# EasyEDA Pro project 8CH_ADC_CAPTURE_CARD.epro, board 8CH_ADC_CARD_V3.1
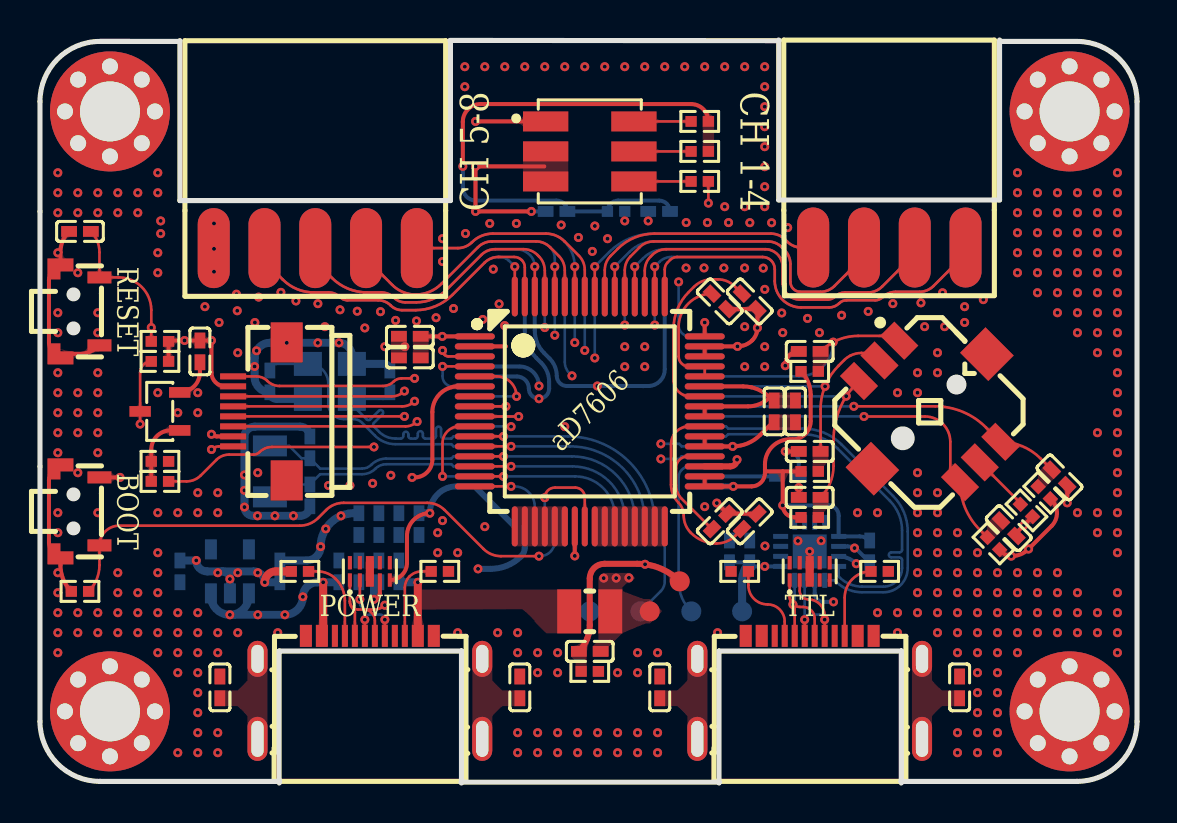
[diagram p12: board, top side]
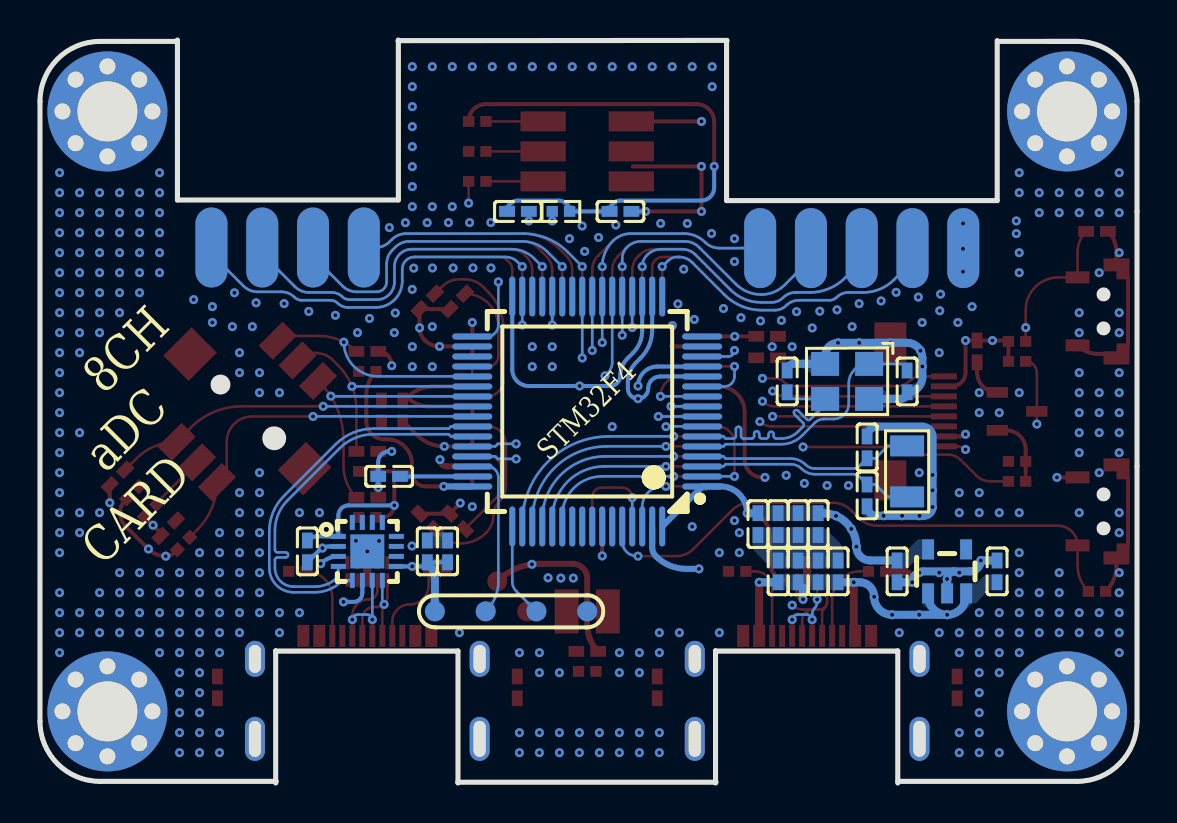
[diagram p13: board, bottom side, seen from below]

Outline 54.87 x 37.15 mm; copper layers: Top Layer, Inner1, Inner2, Bottom Layer. Coordinates in mm from the lower left corner of the outline.
Outline path: 3,37.08 arc(0.88,36.2) 0,34.08 0,3.08 arc(0.88,0.96) 3,0.08 11.97,0.08 ; 3,37.08 4.48,37.08 ; 3,37.08 6.96,37.08 ; 33.97,0.04 21.06,0.04 ; 36.96,37.12 20.5,37.13 ; 48.01,37.08 51.87,37.08 arc(53.99,36.2) 54.87,34.08 54.87,3.08 arc(53.99,0.96) 51.87,0.08 43.06,0.08
Stack: Top Layer 0.035mm 外层铜厚1oz / Dielectric1 0.2104mm 7628 RC49% 8.6mil / Inner1 0.0152mm 内层铜厚 / Dielectric2 1.065mm 1.1mm H/HOZ 含铜 / Inner2 0.0152mm 内层铜厚 / Dielectric3 0.2104mm 7628 RC49% 8.6mil / Bottom Layer 0.035mm 外层铜厚1oz

## Design rules (mm)
net RXD: DP1
net TXD: DP1
net OSC_IN: DP3
net OSC_OUT: DP3
net OSC_32_IN: DP2
net OSC_32_OUT: DP2
net OTG_D+: DP4
net OTG_D-: DP4
template: 自定义配置
spacing copperThickness1oz (default): track to track 0.102, other pairs 0.152 to 0.3
spacing copperThickness2oz: track to track 0.203, other pairs 0.152 to 0.3
spacing SIGNAL: track to track 0.26, other pairs 0.152 to 0.3
track width copperThickness1oz (default): min 0.127, default 0.254, max 2.54
track width copperThickness2oz: min 0.203, default 0.254, max 2.54
track width ADC_CH: min 0.13, default 0.13, max 0.13
track width POWER: min 0.2, default 0.3, max 1
track width SIGNAL: min 0.13, default 0.13, max 0.13
differential pair differentialPair (default): width min 0.127, default 0.254, max 2.54; gap min 0.152, default 0.152
via viaSize (default): diameter min 0.45, default 0.45, max 0.45; hole min 0.2, default 0.2, max 0.2
net NRST uses SIGNAL
net BOOT0 uses SIGNAL
net IPS_SDA uses SIGNAL
net IPS_SCL uses SIGNAL
net DVCC uses POWER
net DGND uses POWER
net IPS_BL uses SIGNAL
net AGND uses POWER
net AVCC uses POWER
net AGND_CH0 uses SIGNAL
net ADC_CH0 uses ADC_CH, SIGNAL
net AGND_CH1 uses SIGNAL
net AGND_CH2 uses SIGNAL
net AGND_CH3 uses SIGNAL
net AGND_CH4 uses SIGNAL
net AGND_CH5 uses SIGNAL
net AGND_CH6 uses SIGNAL
net ADC_CH6 uses ADC_CH, SIGNAL
net AGND_CH7 uses SIGNAL
net ADC_CH7 uses ADC_CH, SIGNAL
net ADC_CH5 uses ADC_CH, SIGNAL
net ADC_CH4 uses ADC_CH, SIGNAL
net ADC_CH3 uses ADC_CH, SIGNAL
net ADC_CH2 uses ADC_CH, SIGNAL
net ADC_CH1 uses ADC_CH, SIGNAL
net ADC_RESET uses SIGNAL
net ADC_CONVST_B uses SIGNAL
net ADC_CONVST_A uses SIGNAL
net ADC_RANGE uses SIGNAL
net ADC_OS2 uses SIGNAL
net ADC_OS1 uses SIGNAL
net ADC_OS0 uses SIGNAL
net IPS_CS uses SIGNAL
net ADC_DB7 uses SIGNAL
net ADC_DB0 uses SIGNAL
net ADC_FRSTDATA uses SIGNAL
net ADC_BUSY uses SIGNAL
net ADC_CS uses SIGNAL
net ADC_RD uses SIGNAL
net RXD uses SIGNAL
net TXD uses SIGNAL
net TTL_D+ uses SIGNAL
net TTL_D- uses SIGNAL
net OSC_IN uses SIGNAL
net OSC_OUT uses SIGNAL
net OSC_32_IN uses SIGNAL
net OSC_32_OUT uses SIGNAL
net UP uses SIGNAL
net PRRESS uses SIGNAL
net LEFT uses SIGNAL
net DOWN uses SIGNAL
net RIGHT uses SIGNAL
net OTG_D+ uses SIGNAL
net OTG_D- uses SIGNAL
net USER uses SIGNAL
net IPS_RESET uses SIGNAL
net IPS_DC uses SIGNAL
net VCC_POWER uses POWER
net SWCLK uses SIGNAL
net SWDIO uses SIGNAL

## Placement (name value [footprint] x y rotation side)
C34  100nF  [C0402]  2 27.58 0 top
C58  12pF  [C0402]  13.5 14.38 90 bottom
C59  12pF  [C0402]  13.5 16.78 270 bottom
C60  10pF  [C0402]  11.5 20.08 270 bottom
C61  10pF  [C0402]  17.5 20.08 270 bottom
C65  100nF  [C0402]  24 4.78 270 top
C72  100nF  [C0402]  38.5 21.58 180 top
C81  4.7uF  [C0402]  30.97 28.58 180 bottom
C103  100nF  [C0402]  8 21.58 270 top
C104  1uF  [C0402]  34 13.08 45 top
C105  1uF  [C0402]  35.5 13.08 45 top
C106  1uF  [C0402]  35.5 24.08 315 top
C107  10uF  [C0402]  34 24.08 315 top
C108  100nF  [C0402]  46 4.78 270 top
C122  4.7uF  [C0402]  18.5 22.34 0 top
C130  4.7uF  [C0402]  15.95 12.95 90 bottom
C133  100nF  [C0402]  51 15.28 315 top
C134  100nF  [C0402]  38.5 14.28 180 top
C135  100nF  [C0402]  48.46 12.74 135 top
C136  100nF  [C0402]  38.5 16.58 0 top
C137  4.7uF  [C0402]  37.41 15.33 0 bottom
C138  100nF  [C0402]  35.5 11.58 90 bottom
C139  100nF  [C0402]  41.5 11.58 270 bottom
C151  100nF  [C0402]  14.95 10.58 270 bottom
C152  100nF  [C0402]  15.95 10.58 270 bottom
C153  100nF  [C0402]  16.95 10.58 270 bottom
C154  4.7uF  [C0402]  17.95 10.58 270 bottom
C155  10uF  [C0402]  12 10.58 90 bottom
C158  100nF  [C0402]  27.5 6.58 0 top
C165  100nF  [C0402]  16.95 12.95 270 bottom
C166  100nF  [C0402]  17.95 12.95 270 bottom
C167  100nF  [C0402]  18.96 12.95 270 bottom
C168  4.7uF  [C0402]  37.79 18.58 270 top
C169  100nF  [C0402]  9 4.78 270 top
C170  100nF  [C0402]  31 4.78 270 top
C171  10uF  [C0402]  7 10.58 270 bottom
C174  10uF  [C0402]  34.49 11.58 270 bottom
C175  10uF  [C0402]  25.84 28.58 180 bottom
C176  100nF  [C0402]  18.5 21.26 0 top
C177  100nF  [C0402]  36.72 18.58 270 top
FPC1  AFC01-S08FCA-00  [fpc-smd_p0.50-8p_fgs-xj-h2.0]  11 18.58 270 top
L1  10uH  [IND-SMD_L2.5-W2.0]  27.5 8.58 0 top
LED6  TC5050RGBF08-3CJH-AF53A  [led-smd_6p-l5.0-w5.0-tl_tc5050rgbf08]  27.5 31.58 0 top
NOREF  -  [Pad_e126]  5.75 3.58 45 top
NOREF#2  -  [Pad_e116]  51.5 31.33 45 top
NOREF#3  -  [Pad_e111]  51.5 35.83 45 top
NOREF#4  -  [Pad_e43]  1.91 31.99 45 top
NOREF#5  -  [Pad_e127]  5.09 5.17 45 top
NOREF#6  -  [Pad_e129]  1.91 5.17 45 top
NOREF#7  -  [Pad_e122]  49.25 3.58 45 top
NOREF#8  -  [Pad_e135]  3.5 1.33 45 top
NOREF#9  -  [Pad_e115]  49.91 31.99 45 top
NOREF#10  -  [Pad_e120]  51.5 5.83 45 top
NOREF#11  -  [Pad_e114]  49.25 33.58 45 top
NOREF#12  -  [Pad_e48]  5.09 35.17 45 top
NOREF#13  -  [Pad_e137]  3.5 3.58 0 top
NOREF#14  -  [Pad_e138]  51.5 3.58 0 top
NOREF#15  -  [Pad_e136]  51.5 33.58 0 top
NOREF#16  -  [Pad_e130]  1.25 3.58 45 top
NOREF#17  -  [Pad_e119]  53.09 5.17 45 top
NOREF#18  -  [Pad_e46]  3.5 31.33 45 top
NOREF#19  -  [Pad_e123]  49.91 1.99 45 top
NOREF#20  -  [Pad_e113]  49.91 35.17 45 top
NOREF#21  -  [Pad_e124]  51.5 1.33 45 top
NOREF#22  -  [Pad_e125]  53.09 1.99 45 top
NOREF#23  -  [Pad_e49]  5.09 31.99 45 top
NOREF#24  -  [Pad_e118]  53.75 3.58 45 top
NOREF#25  -  [Pad_e134]  3.5 33.58 0 top
NOREF#26  -  [Pad_e121]  49.91 5.17 45 top
NOREF#27  -  [Pad_e117]  53.09 31.99 45 top
NOREF#28  -  [Pad_e60]  5.75 33.58 45 top
NOREF#29  -  [Pad_e139]  5.09 1.99 45 top
NOREF#30  -  [Pad_e63]  53.75 33.58 45 top
NOREF#31  -  [Pad_e64]  53.09 35.17 45 top
NOREF#32  -  [Pad_e132]  1.91 1.99 45 top
NOREF#33  -  [Pad_e47]  1.25 33.58 45 top
NOREF#34  -  [Pad_e58]  1.91 35.17 45 top
NOREF#35  -  [Pad_e128]  3.5 5.83 45 top
NOREF#36  -  [Pad_e51]  3.5 35.83 45 top
Q1  S8050  [SOT-23-3_L2.9-W1.3-P1.90-LS2.3-BR]  6 18.58 0 top
R18  10kΩ  [R0402]  2 9.58 180 top
R20  10kΩ  [R0402]  6 22.08 0 top
R77  5.1kΩ  [R0402]  13 10.58 180 top
R78  5.1kΩ  [R0402]  20 10.58 0 top
R79  100Ω  [R0402]  49.34 13.63 135 top
R84  680Ω  [R0402]  33 33.08 0 top
R97  10Ω  [R0402]  6 21.08 0 top
R101  5.1kΩ  [R0402]  35 10.58 180 top
R102  5.1kΩ  [R0402]  42 10.58 0 top
R103  680Ω  [R0402]  33 31.58 0 top
R104  680Ω  [R0402]  33 30.08 0 top
R106  10kΩ  [R0402]  38.5 20.58 180 top
R107  10kΩ  [R0402]  50.23 14.52 315 top
R108  10kΩ  [R0402]  38.5 13.28 180 top
R109  10kΩ  [R0402]  47.69 11.98 315 top
R110  10kΩ  [R0402]  38.5 15.58 180 top
R111  10kΩ  [R0402]  28.82 28.58 180 bottom
R112  0Ω  [R0402]  27.5 5.58 0 top
R115  4.7kΩ  [R0402]  6 15.08 0 top
R116  3.3kΩ  [R0402]  6 16.08 180 top
SW4  TM-4175-B-B  [SW-SMD_TM-4175-B-X]  44.5 18.58 315 top
SW5  TS24CA  [SW-SMD_TS24CA]  2 23.58 90 top
SW6  TS24CA  [SW-SMD_TS24CA]  2 13.58 90 top
U20  CH343P  [TQFN-16_L3.0-W3.0-P0.50-BL-EP1.7]  38.5 11.58 270 bottom
U29  AD7606BSTZ  [LQFP-64_L10.0-W10.0-P0.50-LS12.0-BL]  27.5 18.58 270 top
U33  2.54-2*4  [hdr-th_8p-p2.54-v-f-r2-c4-s2.54]  42.49 26.28 0 top
U34  -  [焊盘]  30.5 8.58 0 top
U35  STM32F405RGT6  [焊盘]  32 10.08 0 top
U35#2  -  [LQFP-64_L10.0-W10.0-P0.50-LS12.0-BL]  27.5 18.58 90 bottom
U36  -  [焊盘]  35.12 8.58 180 bottom
U37  RCLAMP0524P-ES  [DFN2510-10_L2.5-W1.0-P0.50-BL]  16.5 10.58 0 top
U37#2  -  [焊盘]  27.5 8.58 180 bottom
U37#3  -  [焊盘]  30.04 8.58 180 bottom
U38  RCLAMP0524P-ES  [DFN2510-10_L2.5-W1.0-P0.50-BL]  38.5 10.58 0 top
U38#2  -  [焊盘]  32.58 8.58 180 bottom
U47  2.54-2*5  [hdr-th_10p-p2.54-v-f-r2-c5-s2.54]  13.77 26.25 0 top
U48  HT7833  [SOT-23-5_L2.9-W1.6-P0.95-LS2.8-BL]  9.5 10.58 180 bottom
USB2  TYPEC-302-BRP16SC16  [USB-C-SMD_TYPEC-302-BRP16SC16]  16.5 4.78 0 top
USB3  TYPEC-302-BRP16SC16  [USB-C-SMD_TYPEC-302-BRP16SC16]  38.5 4.78 0 top
X1  8MHz  [OSC-SMD_4P-L3.2-W2.5-BL]  14.5 20.08 0 bottom
X2  32.768kHz  [OSC-SMD_L3.2-W1.5]  11.5 15.58 90 bottom

## Footprints (pads in the part's own frame, mm; a bottom-side part is the same pattern mirrored in y, then rotated)
C0402
  rect 0.79x0.54 smd: 1(-0.545,0) 2(0.545,0)
DFN2510-10_L2.5-W1.0-P0.50-BL
  rect 0.2x0.665 smd: 1(-1,-0.433) 2(-0.5,-0.433) 4(0.5,-0.433) 5(1,-0.433) 6(1,0.433) 7(0.5,0.433) 9(-0.5,0.433) 10(-1,0.433)
  rect 0.4x0.665 smd: 3(0,-0.433) 8(0,0.433)
fpc-smd_p0.50-8p_fgs-xj-h2.0
  rect 0.3x1.3 smd: 1(-1.75,-1.34) 2(-1.252,-1.339) 3(-0.75,-1.34) 4(-0.25,-1.34) 5(0.25,-1.34) 6(0.75,-1.34) 7(1.25,-1.34) 8(1.75,-1.34)
  rect 2x1.6 smd: 9(3.45,1.34) 10(-3.45,1.34)
hdr-th_8p-p2.54-v-f-r2-c4-s2.54
  oval 1.6x4 smd: 1(-3.81,0.5) 3(-1.27,0.5) 5(1.27,0.5) 7(3.81,0.5)
  oval 1.6x4 smd far side: 2(-3.81,0.5) 4(-1.27,0.5) 6(1.27,0.5) 8(3.81,0.5)
hdr-th_10p-p2.54-v-f-r2-c5-s2.54
  oval 1.6x4 smd: 1(-5.08,0.5) 3(-2.54,0.5) 5(0,0.5) 7(2.54,0.5) 9(5.08,0.5)
  oval 1.6x4 smd far side: 2(-5.08,0.5) 4(-2.54,0.5) 6(0,0.5) 8(2.54,0.5) 10(5.08,0.5)
IND-SMD_L2.5-W2.0
  rect 1.2x2.2 smd: 1(1.028,0) 2(-1.028,0)
led-smd_6p-l5.0-w5.0-tl_tc5050rgbf08
  rect 2.265x1 smd: 1(-2.208,1.5) 2(-2.208,0) 3(-2.208,-1.5) 4(2.208,-1.5) 5(2.208,0) 6(2.208,1.5)
LQFP-64_L10.0-W10.0-P0.50-LS12.0-BL
  oval 0.3x2 smd: 1(-3.75,-5.75) 2(-3.25,-5.75) 3(-2.75,-5.75) 4(-2.25,-5.75) 5(-1.75,-5.75) 6(-1.25,-5.75) 7(-0.75,-5.75) 8(-0.25,-5.75) 9(0.25,-5.75) 10(0.75,-5.75) 11(1.25,-5.75) 12(1.75,-5.75) 13(2.25,-5.75) 14(2.75,-5.75) 15(3.25,-5.75) 16(3.75,-5.75) 33(3.75,5.75) 34(3.25,5.75) 35(2.75,5.75) 36(2.25,5.75) 37(1.75,5.75) 38(1.25,5.75) 39(0.75,5.75) 40(0.25,5.75) 41(-0.25,5.75) 42(-0.75,5.75) 43(-1.25,5.75) 44(-1.75,5.75) 45(-2.25,5.75) 46(-2.75,5.75) 47(-3.25,5.75) 48(-3.75,5.75)
  oval 2x0.3 smd: 17(5.75,-3.75) 18(5.75,-3.25) 19(5.75,-2.75) 20(5.75,-2.25) 21(5.75,-1.75) 22(5.75,-1.25) 23(5.75,-0.75) 24(5.75,-0.25) 25(5.75,0.25) 26(5.75,0.75) 27(5.75,1.25) 28(5.75,1.75) 29(5.75,2.25) 30(5.75,2.75) 31(5.75,3.25) 32(5.75,3.75) 49(-5.75,3.75) 50(-5.75,3.25) 51(-5.75,2.75) 52(-5.75,2.25) 53(-5.75,1.75) 54(-5.75,1.25) 55(-5.75,0.75) 56(-5.75,0.25) 57(-5.75,-0.25) 58(-5.75,-0.75) 59(-5.75,-1.25) 60(-5.75,-1.75) 61(-5.75,-2.25) 62(-5.75,-2.75) 63(-5.75,-3.25) 64(-5.75,-3.75)
OSC-SMD_4P-L3.2-W2.5-BL
  rect 1.4x1.2 smd: 1(-1.1,-0.875) 2(1.1,-0.875) 3(1.1,0.875) 4(-1.1,0.875)
OSC-SMD_L3.2-W1.5
  rect 1.05x1.7 smd: 1(-1.275,0) 2(1.275,0)
Pad_e43
  round 1.3 hole 0.8: 1(0,0)
Pad_e46
  round 1.3 hole 0.8: 1(0,0)
Pad_e47
  round 1.3 hole 0.8: 1(0,0)
Pad_e48
  round 1.3 hole 0.8: 1(0,0)
Pad_e49
  round 1.3 hole 0.8: 1(0,0)
Pad_e51
  round 1.3 hole 0.8: 1(0,0)
Pad_e58
  round 1.3 hole 0.8: 1(0,0)
Pad_e60
  round 1.3 hole 0.8: 1(0,0)
Pad_e63
  round 1.3 hole 0.8: 1(0,0)
Pad_e64
  round 1.3 hole 0.8: 1(0,0)
Pad_e111
  round 1.3 hole 0.8: 1(0,0)
Pad_e113
  round 1.3 hole 0.8: 1(0,0)
Pad_e114
  round 1.3 hole 0.8: 1(0,0)
Pad_e115
  round 1.3 hole 0.8: 1(0,0)
Pad_e116
  round 1.3 hole 0.8: 1(0,0)
Pad_e117
  round 1.3 hole 0.8: 1(0,0)
Pad_e118
  round 1.3 hole 0.8: 1(0,0)
Pad_e119
  round 1.3 hole 0.8: 1(0,0)
Pad_e120
  round 1.3 hole 0.8: 1(0,0)
Pad_e121
  round 1.3 hole 0.8: 1(0,0)
Pad_e122
  round 1.3 hole 0.8: 1(0,0)
Pad_e123
  round 1.3 hole 0.8: 1(0,0)
Pad_e124
  round 1.3 hole 0.8: 1(0,0)
Pad_e125
  round 1.3 hole 0.8: 1(0,0)
Pad_e126
  round 1.3 hole 0.8: 1(0,0)
Pad_e127
  round 1.3 hole 0.8: 1(0,0)
Pad_e128
  round 1.3 hole 0.8: 1(0,0)
Pad_e129
  round 1.3 hole 0.8: 1(0,0)
Pad_e130
  round 1.3 hole 0.8: 1(0,0)
Pad_e132
  round 1.3 hole 0.8: 1(0,0)
Pad_e134
  round 6 hole 3: 101(0,0)
Pad_e135
  round 1.3 hole 0.8: 1(0,0)
Pad_e136
  round 6 hole 3: 101(0,0)
Pad_e137
  round 6 hole 3: 101(0,0)
Pad_e138
  round 6 hole 3: 101(0,0)
Pad_e139
  round 1.3 hole 0.8: 1(0,0)
R0402
  rect 0.566x0.54 smd: 1(-0.433,0) 2(0.433,0)
SOT-23-3_L2.9-W1.3-P1.90-LS2.3-BR
  rect 1.07x0.532 smd: 1(0.99,-0.95) 2(0.99,0.95) 3(-0.99,0)
SOT-23-5_L2.9-W1.6-P0.95-LS2.8-BL
  rect 0.6x1 smd: 1(-0.95,-1.1) 2(0,-1.1) 3(0.95,-1.1) 4(0.95,1.1) 5(-0.95,1.1)
SW-SMD_TM-4175-B-X
  rect 1.7x1 smd: 1(-3.575,1.425) 2(-3.575,0.028) 3(-3.575,-1.425) 4(3.575,1.425) 5(3.575,-0.028) 6(3.575,-1.425)
  rect 2x1.8 smd: 7(0,4.05) 7(0,-4.05)
SW-SMD_TS24CA
  custom 1.05x1.3 smd: 1(-2.125,0.975) 2(2.125,0.975)
  rect 0.6x1.2 smd: 3(-1.7,-0.975) 4(1.7,-0.975)
TQFN-16_L3.0-W3.0-P0.50-BL-EP1.7
  rect 0.25x0.75 smd: 1(-0.749,-1.45) 2(-0.248,-1.45) 3(0.252,-1.45) 4(0.751,-1.45) 9(0.75,1.45) 10(0.25,1.45) 11(-0.25,1.45) 12(-0.749,1.45)
  rect 0.75x0.25 smd: 5(1.45,-0.75) 6(1.45,-0.25) 7(1.45,0.25) 8(1.45,0.75) 13(-1.45,0.75) 14(-1.45,0.25) 15(-1.45,-0.25) 16(-1.45,-0.75)
  rect 1.7x1.7 smd: 17(0.001,0)
USB-C-SMD_TYPEC-302-BRP16SC16
  rect 0.6x1.1 smd: 1(-3.2,2.575) 2(-2.4,2.575) 11(2.4,2.575) 12(3.2,2.575)
  rect 0.3x1.1 smd: 3(-1.75,2.575) 4(-1.25,2.575) 5(-0.75,2.575) 6(-0.25,2.575) 7(0.25,2.575) 8(0.75,2.575) 9(1.25,2.575) 10(1.75,2.575)
  oval 1x1.8 hole 0.61x1.4: 13(-5.62,1.425) 14(5.62,1.425)
  oval 1x2.2 hole 0.61x1.8: 15(-5.62,-2.575) 16(5.62,-2.575)
焊盘
  round 1 smd: 1(0,0)

## Nets
AGND: C104.2 C105.2 C106.2 C107.2 C122.1 C158.1 C168.1 C176.1 C177.1 R112.1 U29.2 U29.17 U29.18 U29.19 U29.20 U29.21 U29.22 U29.25 U29.26 U29.27 U29.28 U29.29 U29.30 U29.31 U29.32 U29.35 U29.40 U29.41 U29.43 U29.46 U29.47 U35.1 U47.1 U47.2
AGND_CH0: U29.50 U33.8
AGND_CH1: U29.52 U33.6
AGND_CH2: U29.54 U33.4
AGND_CH3: U29.56 U33.2
AGND_CH4: U29.58 U47.10
AGND_CH5: U29.60 U47.8
AGND_CH6: U29.62 U47.6
AGND_CH7: U29.64 U47.4
AVCC: C122.2 C158.2 C168.2 C176.2 C177.2 L1.1 LED6.1 U29.1 U29.37 U29.38 U29.48 U34.1
DGND: C34.1 C58.1 C59.1 C60.2 C61.1 C65.1 C72.2 C81.1 C103.2 C108.1 C130.1 C133.2 C134.2 C135.1 C136.1 C137.2 C138.2 C139.2 C151.1 C152.1 C153.1 C154.1 C155.1 C165.2 C166.2 C167.2 C169.1 C170.1 C171.1 C174.1 C175.1 FPC1.7 FPC1.9 FPC1.10 Q1.2 R18.2 R77.2 R78.2 R79.1 R84.2 R101.2 R102.2 R103.2 R111.2 R112.2 R116.1 SW5.1 SW5.2 SW5.3 SW6.1 SW6.2 U20.2 U20.17 U35#2.12 U35#2.18 U35#2.63 U37.3 U37.8 U37#2.1 U38.3 U38.8 U48.2 USB2.1 USB2.12 USB3.1 USB3.12 X1.2 X1.4
DVCC: C103.1 C130.2 C138.1 C139.1 C155.2 C165.1 C166.1 C167.1 C174.2 C175.2 FPC1.2 LED6.2 LED6.3 R20.2 R97.2 R106.2 R107.2 R108.2 R109.2 R110.2 SW6.4 U20.1 U20.3 U20.6 U20.9 U29.6 U29.23 U29.33 U29.34 U35#2.1 U35#2.13 U35#2.19 U35#2.32 U35#2.48 U35#2.64 U36.1 U37.5 U48.5
VCC_POWER: C151.2 C152.2 C153.2 C154.2 C171.2 L1.2 U37.4 U48.1 U48.3 USB2.2 USB2.11
ADC_BUSY: U29.14 U35#2.53
ADC_CH0: U29.49 U33.7
ADC_CH1: U29.51 U33.5
ADC_CH2: U29.53 U33.3
ADC_CH3: U29.55 U33.1
ADC_CH4: U29.57 U47.9
ADC_CH5: U29.59 U47.7
ADC_CH6: U29.61 U47.5
ADC_CH7: U29.63 U47.3
ADC_CONVST_A: U29.9 U35#2.8
ADC_CONVST_B: U29.10 U35#2.2
ADC_CS: U29.13 U35#2.52
ADC_DB0: U29.16 U35#2.62
ADC_DB7: U29.24 U35#2.61
ADC_FRSTDATA: U29.15 U35#2.54
ADC_OS0: U29.3 U35#2.14
ADC_OS1: U29.4 U35#2.11
ADC_OS2: U29.5 U35#2.10
ADC_RANGE: U29.8 U35#2.9
ADC_RD: U29.12 U35#2.51
ADC_RESET: U29.11 U35#2.50
BOOT0: R18.1 SW6.3 U35#2.60
DOWN: C135.2 R109.1 SW4.6 U35#2.41
IPS_BL: R115.2 U35#2.22
IPS_CS: FPC1.1 U35#2.20
IPS_DC: FPC1.5 U35#2.24
IPS_RESET: FPC1.6 U35#2.25
IPS_SCL: FPC1.3 U35#2.21
IPS_SDA: FPC1.4 U35#2.23
LEFT: C134.1 R108.1 SW4.3 U35#2.39
NRST: C34.2 R20.1 SW5.4 U35#2.7
OSC_32_IN: C58.2 U35#2.3 X2.1
OSC_32_OUT: C59.2 U35#2.4 X2.2
OSC_IN: C60.1 U35#2.5 X1.1
OSC_OUT: C61.2 U35#2.6 X1.3
OTG_D+: U35#2.45 U37.2 USB2.6 USB2.8
OTG_D-: U35#2.44 U37.1 USB2.5 USB2.7
PRRESS: C136.2 R110.1 SW4.2 U35#2.38
RIGHT: C133.1 R107.1 SW4.4 U35#2.40
RXD: U20.4 U35#2.43
SWCLK: U35#2.49 U37#3.1
SWDIO: U35#2.46 U38#2.1
TTL_D+: U20.7 U38.2 USB3.6 USB3.8
TTL_D-: U20.8 U38.1 USB3.5 USB3.7
TXD: U20.5 U35#2.42
UP: C72.1 R106.1 SW4.1 U35#2.37
USER: R104.2 U35#2.33
$1N3863: R77.1 USB2.4
$1N3864: R78.1 USB2.10
$1N14437: C81.2 U35#2.31
$1N15249: R101.1 USB3.4
$1N15250: R102.1 USB3.10
$1N20405: LED6.6 R84.1
$1N20444: LED6.5 R103.1
$1N20483: LED6.4 R104.1
$1N20665: R79.2 SW4.5
$1N21331: R111.1 U35#2.28
$1N23387: C137.1 U35#2.47
$1N27774: C65.2 USB2.14 USB2.16
$1N27783: C169.2 USB2.13 USB2.15
$1N27801: C108.2 USB3.14 USB3.16
$1N27807: C170.2 USB3.13 USB3.15
$1N29540: Q1.1 R115.1 R116.2
$1N29631: FPC1.8 Q1.3 R97.1
$2N5032: C104.1 U29.36
$2N5113: C105.1 U29.39
$2N5155: C106.1 U29.42
$2N5232: C107.1 U29.44 U29.45

Pads without a net: NOREF 1; NOREF#2 1; NOREF#3 1; NOREF#4 1; NOREF#5 1; NOREF#6 1; NOREF#7 1; NOREF#8 1; NOREF#9 1; NOREF#10 1; NOREF#11 1; NOREF#12 1; NOREF#13 101; NOREF#14 101; NOREF#15 101; NOREF#16 1; NOREF#17 1; NOREF#18 1; NOREF#19 1; NOREF#20 1; NOREF#21 1; NOREF#22 1; NOREF#23 1; NOREF#24 1; NOREF#25 101; NOREF#26 1; NOREF#27 1; NOREF#28 1; NOREF#29 1; NOREF#30 1; NOREF#31 1; NOREF#32 1; NOREF#33 1; NOREF#34 1; NOREF#35 1; NOREF#36 1; SW4 7; U20 10 11 12 13 14 15 16; U29 7; U35#2 15 16 17 26 27 29 30 34 35 36 55 56 57 58 59; U37 6 7 9 10; U38 4 5 6 7 9 10; U48 4; USB2 3 9; USB3 2 3 9 11

## Via types
v1: diameter 0.45, hole 0.2, Top Layer to Bottom Layer, 497 vias

## Routing (per net, layer and track width the routed paths; a pad name or vN(x,y) marks a point on that pad's centre or on a via; arc(x,y) is an arc through that point)
AGND: length 30.4
  Top Layer w0.2: C105.2 C104.2 v1(33.85,14) ; U29.40 U29.41 35.41,18.83 arc(36,18.95) 36.5,19.28 arc(36.08,19.6) 35.59,19.79 arc(35.38,19.82) 35.17,19.83 U29.43 ; C107.2 C106.2 v1(35.89,22.76) arc(35.82,22.42) 35.63,22.14 arc(35.29,21.91) v1(34.89,21.83) U29.47 U29.46 ; U47.1 8.7,26.73 v1(8.7,26.71) v1(8.7,25.57) ; U29.2 23.31,21.83
  Top Layer w0.3: U29.35 34.53,15.83 arc(34.77,15.93) v1(34.87,16.17) ; C158.1 arc(27.19,6.88) 27.37,7.21 arc(27.47,7.55) 27.5,7.9 27.5,10.23 arc(27.71,10.75) 28.23,10.96 29.88,10.96 arc(30.07,10.96) v1(30.27,10.94) arc(31.07,10.72) 31.78,10.28 arc(31.89,10.19) U35.1
  Bottom Layer w0.3: v1(8.7,27.98) v1(8.7,26.71)
  vias: v1(8.25,23.82) v1(8.96,23.03) v1(9.83,24.44) v1(9.87,23.61) v1(10.75,23.03) v1(10.94,24.3) v1(12.05,24.53) v1(12.8,24.1) v1(13.9,23.97) v1(14.25,22.82) v1(15.01,23.66) v1(15.87,23.59) v1(16.25,22.75) v1(17.03,23.57) v1(17.25,21.82) v1(17.79,23.13) v1(18.25,21.82) v1(18.83,23.11) v1(19.81,23.27) v1(20.13,27.22) v1(20.13,26.07) v1(20.69,23.73) v1(21.25,35.82) v1(21.25,34.82) v1(21.28,27.48) v1(22.15,23.18) v1(22.25,35.82) v1(22.25,12.82) v1(22.5,27.98) v1(22.67,25.69) v1(22.96,23.96) v1(23.24,22.87) v1(23.25,35.82) v1(23.83,27.98) v1(24.25,35.82) v1(25.25,35.82) v1(26.07,27.9) v1(26.25,35.82) v1(26.25,17.82) v1(26.93,27.28) v1(27.25,35.82) v1(27.63,26.58) v1(27.75,27.85) v1(28.25,35.82) v1(28.39,27.22) v1(29.25,35.82) v1(29.25,21.82) v1(29.25,20.82) v1(30.25,35.82) v1(30.25,21.82) v1(30.25,20.82) v1(31.25,35.82) v1(32.25,35.82) v1(32.32,28.03) v1(32.32,25.75) v1(33.22,25.76) v1(33.25,35.82) v1(33.25,13.82) v1(33.38,28.02) v1(34.21,25.75) v1(34.25,35.82) v1(34.25,28.82) v1(34.44,28.02) v1(35.24,25.75) v1(35.25,35.82) v1(35.25,28.82) v1(35.25,22.82) v1(35.25,20.82) v1(35.51,28.02) v1(36.18,25.75) v1(36.25,35.82) v1(36.25,34.82) v1(36.25,33.82) v1(36.25,32.82) v1(36.25,31.82) v1(36.25,30.82) v1(36.25,29.82) v1(36.25,28.82) v1(36.25,24.68) v1(36.25,21.82) v1(36.25,20.82) v1(36.59,28.02) v1(37.1,23.5) v1(37.15,22.52) v1(37.4,27.77) v1(38.39,23.23) v1(38.99,22.52) v1(40.1,23.39) v1(41.43,23.58) v1(42.66,23.97) v1(44.06,24.01) v1(44.25,22.82) v1(45.15,24.51) v1(45.25,22.82) v1(46.25,23.82) v1(46.25,23.03) v1(47.19,24.17)
AGND_CH0: length 20.2
  Top Layer w0.13: U29.50 v1(30.75,25.82)
  Bottom Layer w0.13: v1(30.75,25.82) 30.98,26.05 arc(31.26,26.24) 31.59,26.3 36.14,26.3 arc(36.57,26.13) 36.75,25.69 36.75,25.1 arc(37.14,24.17) 38.07,23.78 39.47,23.78 arc(39.75,23.84) 39.98,23.99 arc(40.15,24.1) 40.34,24.14 41.78,24.14 arc(41.97,24.18) 42.14,24.29 arc(42.44,24.49) 42.8,24.56 43.99,24.56 arc(44.37,24.64) 44.69,24.85 46.3,26.46 U33.8
AGND_CH1: length 18.7
  Top Layer w0.13: U29.52 v1(29.75,25.82)
  Bottom Layer w0.13: U33.6 43.76,26.46 42.12,24.82 arc(41.8,24.61) 41.41,24.53 40.27,24.53 arc(39.99,24.47) 39.75,24.32 arc(39.59,24.21) 39.4,24.17 38.03,24.17 arc(37.4,24.43) 37.14,25.05 37.14,25.82 arc(36.89,26.44) 36.27,26.69 31.28,26.69 arc(30.67,26.57) 30.16,26.23 v1(29.75,25.82)
AGND_CH2: length 17.3
  Top Layer w0.13: U29.54 v1(28.75,25.82)
  Bottom Layer w0.13: U33.4 41.22,26.33 39.74,24.85 arc(39.42,24.64) 39.03,24.56 38.03,24.56 arc(37.68,24.71) 37.53,25.06 37.53,25.95 arc(37.46,26.33) 37.24,26.66 37.11,26.79 arc(36.78,27.01) 36.4,27.08 30.75,27.08 arc(30.07,26.95) 29.49,26.56 v1(28.75,25.82)
AGND_CH3: length 13.2
  Top Layer w0.13: U29.56 v1(27.75,25.82)
  Bottom Layer w0.13: U33.2 38.08,26.78 arc(37.7,26.85) 37.38,27.07 37.27,27.18 arc(36.94,27.4) 36.56,27.47 30.71,27.47 arc(29.5,27.23) 28.47,26.54 27.75,25.82 v1(27.75,25.82)
AGND_CH4: length 10.6
  Top Layer w0.13: v1(26.75,25.82) U29.58
  Bottom Layer w0.13: U47.10 20.9,26.75 arc(21.28,26.82) 21.61,27.04 arc(22.09,27.36) 22.65,27.47 25.32,27.47 arc(25.81,27.38) 26.22,27.1 arc(26.61,26.51) v1(26.75,25.82)
AGND_CH5: length 14
  Top Layer w0.13: v1(25.75,25.82) U29.60
  Bottom Layer w0.13: v1(25.75,25.82) 25.75,26.22 arc(25.69,26.53) 25.51,26.79 arc(25.19,27.01) 24.81,27.08 22.61,27.08 arc(22.23,27.01) 21.91,26.79 20.07,24.95 arc(19.48,24.56) 18.8,24.42 arc(18.15,24.55) 17.61,24.92 16.46,26.07 arc(16.35,26.23) 16.31,26.42 U47.8
AGND_CH6: length 15.2
  Top Layer w0.13: U29.62 v1(24.75,25.82)
  Bottom Layer w0.13: U47.6 13.77,26.3 arc(13.81,26.1) 13.92,25.94 14.6,25.26 arc(15.41,24.72) 16.36,24.53 17.08,24.53 arc(17.42,24.46) 17.71,24.27 arc(17.97,24.09) 18.27,24.03 18.82,24.03 arc(19.63,24.2) 20.33,24.66 22.08,26.41 arc(22.39,26.62) 22.75,26.69 23.8,26.69 arc(24.18,26.62) 24.51,26.4 arc(24.69,26.13) v1(24.75,25.82)
AGND_CH7: length 16.6
  Top Layer w0.13: U29.64 v1(23.75,25.82)
  Bottom Layer w0.13: v1(23.75,25.82) 23.45,26.12 arc(23.25,26.25) 23.01,26.3 22.9,26.3 arc(22.55,26.23) 22.25,26.03 20.63,24.41 arc(19.78,23.84) 18.78,23.64 18.11,23.64 arc(17.8,23.7) 17.54,23.88 arc(17.26,24.07) 16.91,24.14 15.38,24.14 arc(15.19,24.18) 15.02,24.29 arc(14.75,24.47) 14.44,24.53 13.7,24.53 arc(12.86,24.7) 12.14,25.17 11.38,25.94 arc(11.27,26.1) 11.23,26.3 U47.4
AVCC: length 64.7
  Top Layer w0.2: U29.48 v1(33.25,23.03) ; U29.1 v1(20.12,22.33) 19.05,22.33 arc(19.05,22.33) C122.2 ; v1(21.78,33.08) LED6.1 ; 36.5,17.88 36.02,17.4 arc(35.39,16.98) v1(34.65,16.83) U29.37 U29.38
  Inner1 w0.3: 21.57,23.78 22.49,24.7 arc(22.75,24.87) 23.06,24.93 27.42,24.93 arc(28.19,24.61) 28.52,23.84 28.52,19.37 arc(28.9,18.45) 29.81,18.07 33.41,18.07 arc(34.28,17.71) v1(34.65,16.83) ; 21.57,23.78 v1(20.12,22.33) ; 21.57,23.78 21.57,24.41 arc(21.79,25.52) 22.42,26.46 arc(22.98,27.3) 23.18,28.3 23.18,31.79 arc(22.8,32.7) 21.89,33.08 v1(21.78,33.08) ; 34.65,18.53 34.65,18.74 arc(34.47,19.62) 33.98,20.36 arc(33.44,21.17) 33.25,22.12 v1(33.25,23.03) ; 34.65,18.53 v1(34.65,16.83) ; 34.65,18.53 arc(34.63,18.57) 34.6,18.58 ; v1(28.82,10.25) 28.82,11.77 arc(29.18,12.64) 30.04,12.99 34.61,12.99 arc(35.42,13.33) 35.75,14.14 35.75,15.72 arc(35.43,16.51) v1(34.65,16.83) ; v1(28.2,10.24) 29.44,10.24 arc(29.45,10.25) v1(29.46,10.26)
DGND: length 135.7
  Top Layer w0.2: C133.2 v1(51.38,14.01) ; C103.2 8,20.54 arc(7.7,19.83) Q1.2 ; R79.1 v1(49.22,12.89) 48.95,12.63 arc(48.87,12.5) C135.1 ; v1(21.15,30.83) 21.15,33.06 arc(21.41,33.69) 22.04,33.95 32.57,33.95 arc(33.18,33.7) R84.2 ; v1(37.96,14.77) C134.2 ; FPC1.7 8.84,17.33 arc(8.7,17.36) v1(8.58,17.44) ; v1(37.28,20.87) 37.28,20.91 arc(37.48,21.38) C72.2 ; C136.1 v1(37.28,16.58) ; R18.2 arc(1.17,10.18) 1.03,10.89 SW6.1 arc(0.62,11.63) 0.45,12.03 0.45,15.13 arc(0.62,15.54) SW6.2 ; C34.1 arc(1.14,27.11) 1.03,26.54 SW5.2 arc(0.62,25.54) 0.45,25.13 0.45,22.03 arc(0.62,21.63) SW5.1 1.95,21.46 arc(2.5,21.57) SW5.3
  Top Layer w0.4: R77.2 11.79,10.58 arc(11.4,10.42) v1(11.24,10.04) ; U38.3 U38.8 ; U37.3 U37.8
  Inner1 w0.2: v1(37.28,20.87) v1(37.28,16.58) ; v1(24.96,19.22) 24.96,15.66 arc(24.51,14.58) 23.44,14.14 21.15,14.14 arc(20.43,13.84) v1(20.13,13.12)
  Inner2 w0.2: v1(21.15,30.83) 21.15,29.31 arc(20.94,28.79) 20.42,28.58 7.15,28.58 arc(5.93,28.82) v1(4.89,29.52)
  Bottom Layer w0.2: U35#2.12 23.85,20.33 arc(24.28,20.15) 24.45,19.72 arc(24.6,19.37) v1(24.96,19.22) arc(25.32,19.37) 25.47,19.72 25.47,20.05 arc(25.36,20.57) 25.07,21.01 24.83,21.25 arc(24.4,21.89) 24.25,22.66 U35#2.18 ; v1(37.28,16.58) 37.41,16.58 arc(37.8,16.42) 37.96,16.04 v1(37.96,14.77) ; C139.2 40.92,11.62 arc(40.68,11.78) 40.41,11.83 U20.2 ; v1(21.15,30.83) 21.15,29.78 arc(21.34,29.31) 21.8,29.12 25.84,29.12 arc(26.22,28.96) C175.1 R111.2 arc(28.54,28.96) 28.93,29.12 30.97,29.12 arc(31.35,28.96) C81.1
  Bottom Layer w0.3: U35#2.63 24.25,11.78 arc(24.2,11.54) 24.07,11.34 arc(23.37,10.87) 22.54,10.71 v1(21.91,10.71)
  Bottom Layer w0.4: U48.2 v1(9.5,10.2) arc(9.39,10.47) 9.12,10.58 ; 9.12,10.58 8.36,10.58 arc(7.97,10.74) v1(7.81,11.13) C171.1 ; 9.12,10.58 10.7,10.58 arc(11.08,10.42) v1(11.24,10.04) C155.1 ; X1.4 11.83,19.21 arc(11.6,19.3) C60.2 arc(10.96,19.76) 10.74,20.3 v1(10.74,20.83) 10.74,21.24 arc(10.76,21.43) v1(10.83,21.61) arc(11.11,21.9) 11.5,22.01 v1(12.34,22.01) v1(13.9,22.01) v1(14.96,22.01) arc(15.41,21.82) 15.6,21.37 X1.2 17.17,20.96 arc(17.4,20.86) C61.1 ; C58.1 arc(13.36,13.5) 13.02,13.36 v1(12.68,13.36) v1(11.75,13.36) 10.67,13.36 arc(10.36,13.49) v1(10.23,13.8) v1(10.23,14.64) v1(10.23,15.41) 10.23,17.31 arc(10.38,17.67) 10.74,17.82 13.01,17.82 arc(13.36,17.68) C59.1
  vias: v1(0.89,30.52) v1(0.89,29.52) v1(0.89,28.52) v1(0.89,26.52) v1(0.89,23.52) v1(0.89,22.52) v1(0.89,20.52) v1(0.89,19.52) v1(0.89,18.52) v1(0.89,17.52) v1(0.89,16.52) v1(0.89,13.52) v1(0.89,12.52) v1(0.89,10.52) v1(0.89,9.52) v1(0.89,8.52) v1(0.89,7.52) v1(0.89,6.52) v1(1.89,29.52) v1(1.89,28.52) v1(1.89,25.52) v1(1.89,19.52) v1(1.89,18.52) v1(1.89,17.52) v1(1.89,15.52) v1(1.89,8.52) v1(1.89,7.52) v1(2.89,29.52) v1(2.89,28.52) v1(2.89,23.52) v1(2.89,22.52) v1(2.89,20.52) v1(2.89,19.52) v1(2.89,18.52) v1(2.89,17.52) v1(2.89,16.52) v1(2.89,13.52) v1(2.89,8.52) v1(2.89,7.52) v1(3.89,29.52) v1(3.89,28.52) v1(3.89,10.52) v1(3.89,9.52) v1(3.89,8.52) v1(3.89,7.52) v1(4.89,28.52) v1(4.89,9.52) v1(4.89,8.52) v1(4.89,7.52) v1(5.89,30.52) v1(5.89,29.52) v1(5.89,26.52) v1(5.89,25.52) v1(5.89,19.52) v1(5.89,13.52) v1(5.89,11.52) v1(5.89,10.52) v1(5.89,9.52) v1(5.89,8.52) v1(5.89,7.52) v1(5.89,6.52) v1(6.04,27.47) v1(6.89,18.52) v1(6.89,13.52) v1(6.89,8.52) v1(6.89,7.52) v1(6.89,6.52) v1(6.89,5.52) v1(6.89,1.52) v1(7.89,19.52) v1(7.89,18.52) v1(7.89,14.52) v1(7.89,13.52) v1(7.89,8.52) v1(7.89,7.52) v1(7.89,6.52) v1(7.89,5.52) v1(7.89,4.52) v1(7.89,3.52) v1(7.89,2.52) v1(7.89,1.52) v1(8.89,14.52) v1(8.89,13.52) v1(8.89,10.52) v1(8.89,7.52) v1(8.89,6.52) v1(8.89,2.52) v1(8.89,1.52) v1(9.89,21.52) v1(9.89,10.52) v1(9.89,7.52) v1(10.89,15.52) v1(10.88,13.36) v1(10.89,10.52) v1(11.89,7.52) v1(14.43,14.88) v1(15.5,14.88) v1(16.64,14.98) v1(17.55,15.39) v1(19.89,12.52) v1(19.89,11.52) v1(20.89,11.52) v1(20.89,7.52) v1(22.89,7.52) v1(23.89,7.52) v1(23.89,6.52) v1(23.89,2.52) v1(23.89,1.52) v1(24.89,6.52) v1(24.89,5.52) v1(24.89,2.52) v1(24.89,1.52) v1(25.89,6.52) v1(25.89,5.52) v1(25.89,2.52) v1(25.89,1.52) v1(26.89,2.52) v1(26.89,1.52) v1(27.89,2.52) v1(27.89,1.52) v1(28.89,5.52) v1(28.89,2.52) v1(28.89,1.52) v1(29.89,6.52) v1(29.89,5.52) v1(29.89,2.52) v1(29.89,1.52) v1(30.89,6.52) v1(30.89,2.52) v1(30.89,1.52) v1(33.89,7.52) v1(36.26,11.85) v1(37.91,12.1) v1(38.5,11.58) v1(39.07,12.11) v1(40.74,11.75) v1(40.89,13.52) v1(41.89,13.52) v1(41.89,8.52) v1(42.89,19.52) v1(42.89,8.52) v1(42.89,7.52) v1(43.89,20.52) v1(43.89,19.52) v1(43.89,15.52) v1(43.89,14.52) v1(43.89,13.52) v1(43.89,12.52) v1(43.89,11.52) v1(43.89,10.52) v1(43.89,9.52) v1(43.89,8.52) v1(44.89,21.52) v1(44.89,20.52) v1(44.89,14.52) v1(44.89,13.52) v1(44.89,12.52) v1(44.89,11.52) v1(44.89,10.52) v1(44.89,9.52) v1(44.89,8.52) v1(44.89,7.52) v1(45.89,12.52) v1(45.89,11.52) v1(45.89,10.52) v1(45.89,9.52) v1(45.89,8.52) v1(45.89,7.52) v1(45.89,6.52) v1(45.89,2.52) v1(45.89,1.52) v1(46.89,11.52) v1(46.89,10.52) v1(46.89,9.52) v1(46.89,8.52) v1(46.89,7.52) v1(46.89,6.52) v1(46.89,5.52) v1(46.89,4.52) v1(46.89,3.52) v1(46.89,2.52) v1(46.89,1.52) v1(47.89,10.52) v1(47.89,9.52) v1(47.89,8.52) v1(47.89,7.52) v1(47.89,6.52) v1(47.89,5.52) v1(47.89,4.52) v1(47.89,3.52) v1(47.89,2.52) v1(47.89,1.52) v1(48.89,30.52) v1(48.89,29.52) v1(48.89,28.52) v1(48.89,27.52) v1(48.89,26.52) v1(48.89,25.52) v1(48.89,10.52) v1(48.89,9.52) v1(48.89,8.52) v1(48.89,7.52) v1(48.89,6.52) v1(49.89,29.52) v1(49.89,28.52) v1(49.89,27.52) v1(49.89,26.52) v1(49.89,25.52) v1(49.89,24.52) v1(49.89,10.52) v1(49.89,9.52) v1(49.89,8.52) v1(49.89,7.52) v1(50.89,29.52) v1(50.89,28.52) v1(50.89,27.52) v1(50.89,26.52) v1(50.89,25.52) v1(50.89,24.52) v1(50.89,23.52) v1(50.89,10.52) v1(50.89,9.52) v1(50.89,8.52) v1(50.89,7.52) v1(51.89,29.52) v1(51.89,28.52) v1(51.89,27.52) v1(51.89,26.52) v1(51.89,25.52) v1(51.89,24.52) v1(51.89,23.52) v1(51.89,22.52) v1(51.89,13.52) v1(51.89,9.52) v1(51.89,8.52) v1(51.89,7.52) v1(52.89,29.52) v1(52.89,28.52) v1(52.89,27.52) v1(52.89,26.52) v1(52.89,25.52) v1(52.89,24.52) v1(52.89,23.52) v1(52.89,22.52) v1(52.89,21.52) v1(52.89,17.52) v1(52.89,13.52) v1(52.89,12.52) v1(52.89,8.52) v1(52.89,7.52) v1(53.89,30.52) v1(53.89,29.52) v1(53.89,28.52) v1(53.89,27.52) v1(53.89,26.52) v1(53.89,25.52) v1(53.89,24.52) v1(53.89,23.52) v1(53.89,22.52) v1(53.89,21.52) v1(53.89,20.52) v1(53.89,19.52) v1(53.89,18.52) v1(53.89,17.52) v1(53.89,16.52) v1(53.89,15.52) v1(53.89,14.52) v1(53.89,13.52) v1(53.89,12.52) v1(53.89,11.52) v1(53.89,9.52) v1(53.89,8.52) v1(53.89,7.52) v1(53.89,6.52)
DVCC: length 132.8
  Top Layer w0.2: 36.26,15.66 36.26,15.94 arc(36.63,16.82) 37.51,17.18 37.64,17.18 arc(38.28,17.45) 38.55,18.09 38.55,19.42 arc(38.42,20.05) R106.2 ; 36.26,15.66 36.26,15.5 arc(36.07,15.03) 35.59,14.83 v1(34.68,14.83) U29.33 U29.34 ; 36.26,15.66 arc(36.29,15.61) 36.34,15.58 37.15,15.58 ; v1(24.58,28.58) v1(21.78,28.58) v1(21.78,30.83) 25.23,30.83 ; v1(4,15.28) SW6.4 ; 37.15,15.58 R110.2 ; 37.15,15.58 v1(37.15,13.88) arc(37.33,13.46) 37.75,13.28 R108.2 ; U29.6 20.91,19.83 arc(20,19.46) 19.63,18.55 19.63,16.17 arc(19.37,15.54) 18.74,15.28 v1(18.61,15.28) ; R107.2 50.6,14.15 arc(50.8,13.85) 50.87,13.5 arc(50.8,13.15) 50.6,12.85 v1(49.45,11.7) arc(49.05,11.44) v1(48.58,11.34) arc(48.35,11.39) 48.15,11.52 R109.2 ; R97.2 R20.2 arc(6.48,22.12) 6.54,22.13 v1(7.23,22.13) C103.1 v1(8.58,22.13) 8.58,20.53 arc(8.78,20.04) 9.27,19.83 FPC1.2 ; v1(26.75,11.35) U29.23 ; U37.5 arc(18.11,10.4) 18.36,11 18.36,12.35 arc(18.69,13.16) v1(19.5,13.49)
  Inner1 w0.2: v1(24.96,19.85) v1(27.88,19.85) 27.88,19.39 arc(28.45,18.01) 29.83,17.44 32.58,17.44 arc(33.57,17.03) 33.98,16.04 33.98,15.53 arc(34.18,15.04) v1(34.68,14.83) 30.23,14.83 arc(27.77,13.81) v1(26.75,11.35) ; v1(21.78,28.58) 7.18,28.58 arc(6.56,28.46) v1(6.04,28.11)
  Bottom Layer w0.2: C174.2 C138.1 arc(35.56,10.89) 35.71,10.83 v1(36.25,10.83) U20.9 ; U35#2.13 23.99,20.83 arc(24.67,20.54) v1(24.96,19.85) ; C175.2 v1(24.58,28.58) ; v1(39.69,9.06) 39.18,9.06 arc(38.88,9.18) 38.75,9.49 U20.6 ; U35#2.19 24.75,22.62 arc(24.87,22.02) 25.21,21.5 25.49,21.23 arc(25.76,20.83) 25.85,20.36 arc(26,20) 26.36,19.85 v1(27.88,19.85) 30.17,19.85 ; 30.17,19.85 30.42,19.85 arc(31.01,20.09) 31.25,20.68 31.25,24.33 ; 30.17,19.85 arc(30.17,19.85) 30.17,19.84 ; 40.84,10.96 v1(40.83,10.96) arc(40.43,11.24) U20.3 ; v1(37.15,13.88) 39.44,13.88 arc(39.8,13.73) 39.95,13.37 U20.1 41.01,12.33 arc(41.27,12.28) C139.1
  Bottom Layer w0.3: 21.75,14.83 20.84,14.83 arc(19.89,14.44) v1(19.5,13.49) ; U35#2.64 U35#2.1 ; U35#2.48 arc(33.96,14.83) v1(34.68,14.83)
  Bottom Layer w0.4: C155.2 13.35,11.13 arc(13.84,11.33) v1(14.04,11.82) arc(14.1,12.28) v1(14.29,12.71) arc(14.62,13.09) v1(15.06,13.36) arc(15.24,13.42) 15.43,13.47 arc(15.57,13.49) 15.71,13.49 C130.2 ; U36.1 35.12,10.12 arc(35.22,10.62) C138.1 ; C167.1 v1(19.5,13.49)
VCC_POWER: length 17.7
  Top Layer w0.2: U37.4 17,9.48 arc(16.91,9.27) v1(16.71,9.18)
  Top Layer w0.4: v1(14.16,10.04) 14.16,7.42 arc(14.15,7.38) USB2.2 ; v1(18.9,10.04) USB2.11
  Bottom Layer w0.4: U48.1 10.45,9.36 arc(10.17,8.69) v1(9.5,8.41) ; C151.2 v1(14.16,10.04) 13.88,10.04 arc(13.36,9.82) v1(13.15,9.31) arc(12.89,8.67) v1(12.25,8.41) v1(10.9,8.41) v1(9.5,8.41) ; U48.3 8.55,9.36 arc(8.83,8.69) v1(9.5,8.41) ; v1(16.71,9.18) 16.71,9.79 ; C154.2 v1(18.9,10.04)
ADC_BUSY: length 9.4
  Top Layer w0.13: U29.14 v1(23.56,15.83)
  Bottom Layer w0.13: 29.25,12.83 29.25,13.22 arc(28.48,15.07) 26.64,15.83 v1(23.56,15.83)
ADC_CH0: length 19.7
  Top Layer w0.13: U29.49 31.25,25.68 arc(31.29,25.87) 31.4,26.03 31.52,26.16 arc(31.68,26.26) 31.87,26.3 36.15,26.3 arc(36.57,26.12) 36.75,25.69 36.75,25.1 arc(37.14,24.17) 38.07,23.78 39.47,23.78 arc(39.75,23.84) 39.98,23.99 arc(40.15,24.1) 40.34,24.14 41.78,24.14 arc(41.97,24.18) 42.14,24.29 arc(42.44,24.49) 42.8,24.56 43.99,24.56 arc(44.37,24.64) 44.69,24.85 46.3,26.46 U33.7
ADC_CH1: length 18.3
  Top Layer w0.13: U33.5 43.76,26.46 42.12,24.82 arc(41.8,24.61) 41.41,24.53 40.27,24.53 arc(39.99,24.47) 39.75,24.32 arc(39.59,24.21) 39.4,24.17 38.03,24.17 arc(37.4,24.43) 37.14,25.05 37.14,25.82 arc(36.89,26.44) 36.27,26.69 31.32,26.69 arc(30.94,26.62) 30.62,26.4 30.54,26.32 arc(30.33,26) 30.25,25.62 U29.51
ADC_CH2: length 17
  Top Layer w0.13: U33.3 41.22,26.33 39.74,24.85 arc(39.41,24.63) 39.03,24.56 38,24.56 arc(37.67,24.72) 37.53,25.07 37.53,25.95 arc(37.46,26.33) 37.24,26.66 37.11,26.79 arc(36.78,27.01) 36.4,27.08 30.7,27.08 arc(30.32,27.01) 29.99,26.79 29.54,26.34 arc(29.33,26.02) 29.25,25.63 U29.53
ADC_CH3: length 12.8
  Top Layer w0.13: U33.1 38.08,26.78 arc(37.7,26.85) 37.38,27.07 37.27,27.18 arc(36.94,27.4) 36.56,27.47 30.74,27.47 arc(29.74,27.27) 28.9,26.71 28.54,26.36 arc(28.33,26.03) 28.25,25.65 U29.55
ADC_CH4: length 10.8
  Top Layer w0.13: U47.9 20.9,26.75 arc(21.28,26.82) 21.61,27.04 arc(22.09,27.36) 22.65,27.47 25.31,27.47 arc(25.81,27.37) 26.23,27.09 26.96,26.36 arc(27.17,26.04) 27.25,25.66 U29.57
ADC_CH5: length 14.2
  Top Layer w0.13: U29.59 26.25,25.64 arc(26.17,26.02) 25.96,26.35 25.51,26.79 arc(25.19,27.01) 24.81,27.08 22.61,27.08 arc(22.23,27.01) 21.91,26.79 20.07,24.96 arc(19.48,24.56) 18.79,24.42 arc(18.15,24.55) 17.62,24.91 16.46,26.07 arc(16.35,26.23) 16.31,26.42 U47.7
ADC_CH6: length 15.6
  Top Layer w0.13: U47.5 13.77,26.3 arc(13.81,26.1) 13.92,25.94 14.6,25.26 arc(15.41,24.72) 16.36,24.53 17.08,24.53 arc(17.42,24.46) 17.71,24.27 arc(17.96,24.1) 18.27,24.03 18.82,24.03 arc(19.64,24.2) 20.32,24.66 22.07,26.4 arc(22.39,26.62) 22.78,26.69 24.18,26.69 arc(24.56,26.62) 24.89,26.4 24.96,26.33 arc(25.17,26.01) 25.25,25.62 U29.61
ADC_CH7: length 17.1
  Top Layer w0.13: U29.63 24.25,25.79 arc(24.21,25.98) 24.1,26.14 arc(23.93,26.26) 23.72,26.3 22.94,26.3 arc(22.56,26.23) 22.23,26.01 20.62,24.41 arc(19.78,23.84) 18.79,23.64 18.11,23.64 arc(17.8,23.71) 17.54,23.88 arc(17.26,24.07) 16.91,24.14 15.38,24.14 arc(15.19,24.18) 15.02,24.29 arc(14.75,24.47) 14.44,24.53 13.69,24.53 arc(12.86,24.7) 12.15,25.17 11.38,25.94 arc(11.27,26.1) 11.23,26.3 U47.3
ADC_CONVST_A: length 4.4
  Top Layer w0.13: U29.9 21.75,18.33 v1(23.94,18.33)
  Bottom Layer w0.13: v1(23.94,18.33) 21.75,18.33 U29.9
ADC_CONVST_B: length 5.4
  Top Layer w0.13: U29.10 20.98,17.83 arc(20.38,17.58) 20.13,16.99 v1(20.13,15.33)
  Bottom Layer w0.13: 21.75,15.33 v1(20.13,15.33)
ADC_CS: length 10.1
  Top Layer w0.13: U29.13 v1(23.18,16.33)
  Bottom Layer w0.13: 29.75,12.83 29.75,13.18 arc(28.83,15.41) 26.6,16.33 v1(23.18,16.33)
ADC_DB0: length 4.6
  Top Layer w0.13: U29.16 v1(23.56,14.83)
  Bottom Layer w0.13: v1(23.56,14.83) 23.73,14.83 arc(24.45,14.53) 24.75,13.81 24.75,12.83
ADC_DB7: length 5.5
  Top Layer w0.13: U29.24 27.25,14.29 arc(27.11,14.63) 26.77,14.77 25.76,14.77 arc(25.4,14.62) v1(25.25,14.26)
  Bottom Layer w0.13: 25.25,12.83 v1(25.25,14.26)
ADC_FRSTDATA: length 8.6
  Top Layer w0.13: U29.15 v1(23.18,15.33)
  Bottom Layer w0.13: 28.75,12.83 28.75,13.35 arc(28.17,14.75) 26.77,15.33 v1(23.18,15.33)
ADC_OS0: length 3.6
  Top Layer w0.13: U29.3 20.43,21.33 arc(20.22,21.42) v1(20.13,21.63)
  Bottom Layer w0.13: U35#2.14 20.44,21.33 arc(20.22,21.42) v1(20.13,21.63)
ADC_OS1: length 4
  Top Layer w0.13: U29.4 v1(20.13,20.83)
  Bottom Layer w0.13: U35#2.11 20.64,19.83 arc(20.28,19.98) 20.13,20.33 v1(20.13,20.83)
ADC_OS2: length 4.8
  Top Layer w0.13: U29.5 22.84,20.33 arc(23.55,20.04) v1(23.84,19.33)
  Bottom Layer w0.13: 21.75,19.33 v1(23.84,19.33)
ADC_RANGE: length 3.1
  Top Layer w0.13: U29.8 v1(23.31,18.83)
  Bottom Layer w0.13: v1(23.31,18.83) U29.8
ADC_RD: length 10.9
  Top Layer w0.13: v1(23.56,16.83) U29.12
  Bottom Layer w0.13: 30.25,12.83 30.25,13.1 arc(29.16,15.74) 26.51,16.83 v1(23.56,16.83)
ADC_RESET: length 11.6
  Top Layer w0.13: v1(23.18,17.33) U29.11
  Bottom Layer w0.13: v1(23.18,17.33) 26.4,17.33 arc(29.47,16.06) 30.75,12.98 30.75,12.83
BOOT0: length 28.3
  Top Layer w0.13: v1(24.96,11.34) 23.06,11.34 arc(22.59,11.44) 22.19,11.7 20.24,13.65 arc(19.84,13.92) 19.37,14.01 15.18,14.01 arc(14.71,13.92) 14.31,13.65 13.91,13.25 arc(13.49,12.97) 12.99,12.87 3.96,12.87 arc(3.26,12.58) SW6.3 2.97,10.89 arc(2.83,10.18) R18.1
  Bottom Layer w0.13: 25.75,12.83 25.75,12.09 arc(25.53,11.56) 25.01,11.34 v1(24.96,11.34)
DOWN: length 18.5
  Top Layer w0.13: v1(41.22,18.33) 44.26,18.33 arc(45.16,17.96) 45.53,17.06 45.53,15.53 arc(45.68,15.19) SW4.6 arc(46.28,13.76) 47.01,12.66 47.39,12.28
  Bottom Layer w0.13: 33.25,18.33 41.21,18.33 arc(41.21,18.33) v1(41.22,18.33)
IPS_BL: length 26.1
  Top Layer w0.13: R115.2 7.33,15.08 arc(7.71,15.16) 8.04,15.38 8.82,16.15 arc(9.11,16.35) 9.47,16.42 10.68,16.42 arc(10.85,16.46) 10.99,16.55 arc(11.27,16.74) 11.6,16.8 v1(16.71,16.8)
  Inner1 w0.13: v1(26.61,20.36) 24.28,20.36 arc(23.85,20.27) 23.49,20.03 21.22,17.76 arc(20.16,17.05) 18.91,16.8 v1(16.71,16.8)
  Bottom Layer w0.13: 26.25,24.33 26.25,21.05 arc(26.31,20.75) 26.48,20.49 v1(26.61,20.36)
IPS_CS: length 18.1
  Top Layer w0.13: FPC1.1 10.82,20.33 arc(11.12,20.27) 11.37,20.11 arc(11.65,19.92) 11.98,19.85 17.16,19.85 arc(17.44,19.91) 17.68,20.07 arc(17.87,20.19) 18.08,20.23 v1(18.74,20.23)
  Inner1 w0.13: v1(18.74,20.23) 19.75,20.23 arc(20.93,20.47) 21.92,21.13 22.37,21.58 arc(23.27,22.18) 24.33,22.39 arc(24.83,22.49) v1(25.25,22.77)
  Bottom Layer w0.13: v1(25.25,22.77) 25.25,24.33
IPS_DC: length 21.4
  Top Layer w0.13: FPC1.5 v1(18.23,18.33)
  Inner1 w0.13: v1(27.25,21.63) arc(26.83,21.35) 26.33,21.25 24.47,21.25 arc(23.63,21.08) 22.92,20.61 21.63,19.31 arc(20.82,18.77) 19.86,18.58 18.83,18.58 arc(18.51,18.52) v1(18.23,18.33)
  Bottom Layer w0.13: v1(27.25,21.63) 27.25,24.33
IPS_RESET: length 22.3
  Top Layer w0.13: FPC1.6 18.28,17.83 arc(18.6,17.89) v1(18.86,18.07)
  Inner1 w0.13: v1(18.86,18.07) 19.63,18.07 arc(20.8,18.31) 21.79,18.97 23.15,20.33 arc(23.75,20.73) 24.45,20.87 26.82,20.87 arc(27.32,20.97) v1(27.75,21.25)
  Bottom Layer w0.13: v1(27.75,21.25) 27.75,24.33
IPS_SCL: length 19
  Top Layer w0.13: FPC1.3 17.59,19.33 arc(17.93,19.4) v1(18.23,19.6)
  Inner1 w0.13: v1(18.23,19.6) 19.56,19.6 arc(20.79,19.84) 21.84,20.54 22.62,21.32 arc(23.38,21.83) 24.29,22.01 24.83,22.01 arc(25.33,22.11) v1(25.75,22.39)
  Bottom Layer w0.13: v1(25.75,22.39) 25.75,24.33
IPS_SDA: length 20.4
  Top Layer w0.13: FPC1.4 18.11,18.83 arc(18.45,18.9) v1(18.74,19.09)
  Inner1 w0.13: v1(18.74,19.09) 19.79,19.09 arc(20.81,19.29) 21.68,19.87 22.8,20.99 arc(23.5,21.46) 24.34,21.63 25.8,21.63 arc(26.31,21.73) v1(26.75,22.02)
  Bottom Layer w0.13: v1(26.75,22.02) 26.75,24.33
LEFT: length 13.5
  Top Layer w0.13: C134.1 arc(39.52,15) 39.69,15.84 39.69,17.03 arc(39.84,18.23) v1(40.33,19.34) arc(40.63,19.74) SW4.3
  Bottom Layer w0.13: 33.25,19.33 40.34,19.33 arc(40.35,19.35) v1(40.33,19.34)
NRST: length 29.9
  Top Layer w0.13: R20.1 v1(5.57,22.77) 5.57,23.65 arc(5.09,24.8) 3.93,25.28 SW5.4 2.97,26.54 arc(2.86,27.11) C34.2
  Inner1 w0.13: v1(5.57,22.77) 8.93,19.41 arc(12.38,17.11) 16.45,16.3 19.26,16.3 arc(20.42,16.53) 21.4,17.18 arc(22.11,17.65) 22.94,17.82 v1(23.56,17.82)
  Bottom Layer w0.13: 21.75,17.83 23.53,17.83 arc(23.55,17.83) v1(23.56,17.82)
OSC_32_IN: length 10.9
  Bottom Layer w0.13: X2.1 12.46,14.31 13.08,14.93 C58.2 14.01,15.44 16.11,15.44 arc(16.47,15.51) 16.78,15.72 arc(17.03,15.88) 17.32,15.94 20.58,15.94 20.69,15.83 21.75,15.83
OSC_32_OUT: length 10.9
  Bottom Layer w0.13: X2.2 12.46,16.86 13.08,16.24 C59.2 14.01,15.72 16.11,15.72 arc(16.37,15.77) 16.58,15.91 arc(16.92,16.14) 17.32,16.22 20.58,16.22 20.69,16.33 21.75,16.33
OSC_IN: length 12.9
  Bottom Layer w0.13: 21.75,16.83 20.69,16.83 20.58,16.94 17.79,16.94 arc(17.23,17.05) 16.76,17.37 16.11,18.01 arc(15.9,18.15) 15.66,18.2 15.18,18.2 arc(14.64,18.42) 14.42,18.96 14.42,19.98 arc(14.13,20.67) 13.44,20.96 X1.1 11.83,20.96 arc(11.6,20.86) C60.1
OSC_OUT: length 12.9
  Bottom Layer w0.13: 21.75,17.33 20.69,17.33 20.58,17.22 20.19,17.22 arc(20.1,17.26) 20.06,17.35 20.06,17.69 arc(19.94,17.82) 19.81,17.69 19.81,17.35 arc(19.77,17.26) 19.68,17.22 19.28,17.22 arc(19.19,17.26) 19.15,17.35 19.15,17.47 arc(19.03,17.59) 18.9,17.47 18.9,17.35 arc(18.86,17.26) 18.77,17.22 18.55,17.22 arc(18.46,17.26) 18.43,17.35 18.43,17.44 arc(18.3,17.57) 18.17,17.44 18.17,17.35 arc(18.14,17.26) 18.05,17.22 17.79,17.22 arc(17.34,17.31) 16.96,17.57 16.7,17.82 arc(16.66,17.91) 16.7,18 17.13,18.43 arc(17.13,18.61) 16.95,18.61 16.52,18.18 arc(16.43,18.15) 16.34,18.18 15.54,18.99 15.4,18.99 15.39,19 X1.3 17.17,19.21 arc(17.4,19.3) C61.2
OTG_D+: length 25.9
  Top Layer w0.13: v1(17.25,8.17) USB2.8 ; v1(16.25,8.17) USB2.6 ; v1(16,9.18) U37.2
  Inner1 w0.13: v1(17.25,8.17) 17.57,8.17 17.76,8.35 19.25,8.35 arc(20.7,8.64) 21.93,9.47 22.09,9.63 arc(22.18,9.67) 22.27,9.63 22.49,9.41 arc(22.67,9.41) 22.67,9.59 22.45,9.81 arc(22.42,9.9) 22.45,9.99 22.65,10.19 arc(22.74,10.22) 22.83,10.19 22.97,10.05 arc(23.15,10.05) 23.15,10.23 23.01,10.37 arc(22.97,10.46) 23.01,10.55 28.41,15.94 arc(28.92,16.29) 29.52,16.41 30.28,16.41 30.48,16.2 v1(31.06,16.2)
  Bottom Layer w0.13: 33.25,16.33 32.1,16.33 31.97,16.2 v1(31.06,16.2) ; v1(16,9.18) 16,9.03 arc(16.03,8.89) 16.12,8.76 arc(16.21,8.61) 16.25,8.43 v1(16.25,8.17) arc(16.32,8.35) 16.5,8.42 17,8.42 arc(17.18,8.35) v1(17.25,8.17)
OTG_D-: length 25.9
  Top Layer w0.13: 16.2,8.68 16.73,8.68 arc(17.01,8.73) v1(17.25,8.89) ; 16.2,8.68 15.9,8.68 arc(15.62,8.79) 15.5,9.08 ; 16.2,8.68 arc(16.59,8.51) 16.75,8.12 USB2.7 ; USB2.5 15.75,8.53 arc(15.73,8.61) 15.69,8.68 ; U37.1 15.5,9.08 ; 15.5,9.08 arc(15.54,8.88) 15.65,8.71 15.69,8.68 ; 15.69,8.68 arc(15.69,8.68) 15.68,8.68
  Inner1 w0.13: v1(31.06,16.96) 30.48,16.96 30.28,16.76 29.45,16.76 arc(28.78,16.62) 28.21,16.24 21.68,9.71 arc(20.56,8.97) 19.25,8.71 17.76,8.71 17.57,8.89 v1(17.25,8.89)
  Bottom Layer w0.13: v1(31.06,16.96) 31.97,16.96 32.1,16.83 33.25,16.83
PRRESS: length 12.9
  Top Layer w0.13: C136.2 39.04,18.69 arc(39.11,19.33) 39.31,19.94 arc(39.59,20.43) 39.95,20.87 40.22,21.14 arc(40.37,21.27) 40.53,21.37 arc(40.8,21.47) 41.09,21.5 arc(41.58,21.41) 41.99,21.13
  Bottom Layer w0.13: 33.25,19.83 39.27,19.83
  vias: v1(39.27,19.83)
RIGHT: length 18.4
  Top Layer w0.13: C133.1 50.05,16.23 arc(49.12,16.85) SW4.4 47.31,17.78 arc(46.15,18.56) 44.77,18.84 v1(40.71,18.84)
  Bottom Layer w0.13: 33.25,18.83 40.7,18.83 arc(40.7,18.83) v1(40.71,18.84)
RXD: length 19.6
  Bottom Layer w0.13: U20.4 39.95,10.33 40,10.28 arc(40.51,9.94) 41.12,9.82 42.19,9.82 arc(42.85,10.09) 43.12,10.75 43.12,11.15 arc(43.08,11.24) 42.99,11.28 42.59,11.28 arc(42.46,11.41) 42.59,11.53 42.99,11.53 arc(43.08,11.57) 43.12,11.66 43.12,12.62 arc(42.96,13.44) 42.5,14.12 39.89,16.73 arc(39.11,17.26) 38.18,17.44 34.42,17.44 34.31,17.33 33.25,17.33
SWCLK: length 4.7
  Bottom Layer w0.13: U35#2.49 31.25,10.07 arc(31.2,9.81) 31.05,9.59 U37#3.1
SWDIO: length 8.5
  Bottom Layer w0.13: U38#2.1 32.55,8.61 arc(32.1,9.28) 31.94,10.07 31.94,15.28 arc(32.11,15.67) 32.49,15.83 U35#2.46
TTL_D+: length 7.6
  Top Layer w0.13: USB3.8 v1(39.25,8.17) 39.25,8.36 arc(39.01,8.94) 38.42,9.18 arc(38.12,9.31) 38,9.61 U38.2 ; v1(38.25,8.17) USB3.6
  Bottom Layer w0.13: U20.7 v1(38.25,8.17) arc(38.32,8.35) 38.5,8.42 39,8.42 arc(39.18,8.35) v1(39.25,8.17)
TTL_D-: length 6.9
  Top Layer w0.13: USB3.7 38.75,8.22 arc(38.58,8.63) 38.17,8.8 38.01,8.8 arc(37.83,8.84) 37.67,8.94 arc(37.54,9.11) 37.5,9.32 ; U38.1 37.5,9.32 ; 37.5,9.32 arc(37.54,9.11) v1(37.66,8.93) arc(37.73,8.83) 37.75,8.71 USB3.5
  Bottom Layer w0.13: U20.8 37.75,9.02 arc(37.72,8.96) v1(37.66,8.93)
TXD: length 19.6
  Bottom Layer w0.13: 33.25,17.83 34.31,17.83 34.42,17.72 38.18,17.72 arc(39.21,17.52) 40.09,16.93 42.67,14.35 arc(43.21,13.54) 43.4,12.59 43.4,10.75 arc(43.05,9.89) 42.19,9.54 41.12,9.54 arc(40.4,9.68) 39.8,10.08 39.75,10.13 U20.5
UP: length 11.6
  Top Layer w0.13: 39.04,21.58 arc(39.34,21.83) v1(39.67,22.04) arc(40.28,22.28) 40.93,22.36 42.35,22.36 arc(42.69,22.29) 42.97,22.1
  Bottom Layer w0.13: 33.25,20.33 37.96,20.33 arc(39.17,20.83) v1(39.67,22.04)
USER: length 10.3
  Top Layer w0.13: R104.2 v1(33.43,29)
  Inner1 w0.13: v1(33.43,29) 32.58,29 arc(31.95,28.74) 31.69,28.11 31.69,25.31 arc(31.77,25.13) v1(31.94,25.06)
  Bottom Layer w0.13: U35#2.33 32.52,22.33 arc(32.11,22.49) 31.94,22.9 v1(31.94,25.06)
$1N3863: length 4.4
  Top Layer w0.13: USB2.4 15.25,9.11 arc(15.13,9.7) 14.8,10.2 arc(14.38,10.48) 13.88,10.58 R77.1
$1N3864: length 4.2
  Top Layer w0.13: USB2.10 18.25,9.77 arc(18.31,10.07) 18.48,10.32 arc(18.77,10.51) 19.11,10.58 R78.1
$1N14437: length 7.3
  Inner1 w0.13: v1(30.75,22.9) arc(30.41,23.4) 30.29,24 30.29,27.8 arc(30.33,27.97) v1(30.42,28.11)
  Bottom Layer w0.13: v1(30.42,28.11) 30.42,28.58 ; 30.75,24.33 v1(30.75,22.9)
$1N15249: length 4.3
  Top Layer w0.13: USB3.4 37.25,8.07 arc(37,8.68) 36.39,8.93 arc(35.71,9.21) 35.43,9.89 R101.1
$1N15250: length 4
  Top Layer w0.13: USB3.10 40.25,9.27 arc(40.64,10.2) R102.1
$1N20405: length 2.9
  Top Layer w0.13: LED6.6 R84.1
$1N20444: length 2.9
  Top Layer w0.13: LED6.5 R103.1
$1N20483: length 2.9
  Top Layer w0.13: LED6.4 R104.1
$1N20665: length 2.9
  Top Layer w0.13: SW4.5 48.99,14.05 arc(49.03,14) R79.2
$1N21331: length 7.1
  Inner1 w0.13: v1(29.25,22.9) v1(29.25,28.11)
  Bottom Layer w0.13: v1(29.25,28.11) R111.1 ; v1(29.25,22.9) 29.25,24.33
$1N23387: length 3.6
  Bottom Layer w0.2: 33.25,15.33 C137.1
$1N29540: length 3.6
  Top Layer w0.2: R115.1 R116.2 5.57,16.67 arc(5.85,17.35) 6.53,17.63 Q1.1
$1N29631: length 8.9
  Top Layer w0.13: FPC1.8 8.95,16.83 arc(8.75,16.79) v1(8.58,16.68) ; v1(5.01,17.95) Q1.3 5.01,20.52 arc(5.17,20.92) R97.1
  Inner1 w0.13: v1(8.58,16.68) 6.28,16.68 arc(5.38,17.05) v1(5.01,17.95)
$2N5032: length 5.5
  Top Layer w0.13: C104.1 32.1,14.21 arc(31.89,14.52) 31.82,14.9 31.82,15.76 arc(31.99,16.16) 32.39,16.33 U29.36
$2N5113: length 9.8
  Top Layer w0.13: U29.39 32.46,17.83 arc(31.83,17.57) 31.56,16.93 31.56,14.91 arc(31.66,14.43) 31.93,14.03 arc(32.13,13.73) 32.2,13.38 arc(32.29,12.91) 32.56,12.51 arc(33.14,12.12) 33.84,11.98 arc(34.35,12.08) 34.79,12.37 C105.1
$2N5155: length 9.7
  Top Layer w0.13: C106.1 34.74,24.84 arc(34.36,25.1) 33.9,25.19 33.61,25.19 arc(33.13,25.09) 32.72,24.81 32.45,24.55 arc(31.89,23.71) 31.69,22.72 31.69,20.16 arc(31.93,19.58) 32.52,19.33 U29.42
$2N5232: length 6.2
  Top Layer w0.13: U29.44 U29.45 32.44,20.83 arc(32.09,20.98) 31.94,21.33 31.94,22.8 arc(32.43,23.98) C107.1

## Copper pours and planes (outline as drawn; the poured copper is in the pictures)
AGND on Top Layer: 36.46,19.52 38.05,19.52 38.05,18.73 36.46,18.73
AGND on Top Layer: 27.6,13.83 31.4,13.83 31.4,11.84 27.6,11.84
AGND on Top Layer: 26.56,6.85 27.35,6.85 27.35,5.31 26.56,5.31
AGND on Top Layer: 17.56,22.61 18.35,22.61 18.35,20.99 17.56,20.99
AGND on Top Layer: 7.25,37.12 7.25,23.83 8.3,22.78 10.41,22.78 13.11,20.08 17.5,20.08 19.12,18.46 19.12,15.15 24.45,9.82 29.84,9.82 31.85,11.83 35.08,11.83 36.56,13.31 36.56,16.41 37.15,17.01 37.65,17.01 38.28,17.64 38.28,19.52 38.28,19.52 38.28,19.74 40.77,22.23 46.11,22.23 47.74,23.86 47.74,37.15 7.28,37.15
AGND on Top Layer: 23.6,13.83 26.4,13.83 26.4,11.84 23.6,11.84
AGND on Bottom Layer: 7.25,37.12 7.25,23.83 8.3,22.78 10.41,22.78 13.11,20.08 17.5,20.08 19.12,18.46 19.12,15.15 24.45,9.82 29.84,9.82 31.85,11.83 35.08,11.83 36.56,13.31 36.56,16.41 37.15,17.01 37.65,17.01 38.28,17.64 38.28,19.74 40.77,22.22 40.77,22.23 46.11,22.23 47.74,23.86 47.74,37.15 7.28,37.15
AGND on Inner1: 7.25,37.12 7.25,23.83 8.3,22.78 10.41,22.78 13.11,20.08 17.5,20.08 19.12,18.46 19.12,15.15 24.45,9.82 29.84,9.82 31.85,11.83 35.08,11.83 36.56,13.31 36.56,16.41 37.16,17.01 37.65,17.01 38.28,17.64 38.28,19.74 40.77,22.22 40.77,22.23 46.11,22.23 47.74,23.86 47.74,37.15 7.28,37.15
AGND on Inner2: 7.25,23.83 8.3,22.78 10.41,22.78 13.11,20.08 17.5,20.08 19.12,18.46 19.12,15.15 24.45,9.82 29.84,9.82 31.85,11.83 35.08,11.83 36.56,13.31 36.56,16.41 37.16,17.01 37.65,17.01 38.28,17.64 38.28,19.74 40.77,22.22 40.77,22.23 46.11,22.23 47.74,23.86 47.74,37.15 7.25,37.15
AVCC on Top Layer: 18.65,22.6 19.44,22.6 19.44,20.99 18.65,20.99
AVCC on Top Layer: 27.65,10.5 31.11,10.5 31.11,6.32 27.65,6.32
AVCC on Top Layer: 36.46,18.43 38.06,18.43 38.06,17.64 36.46,17.64
DGND on Top Layer: -3.11,40.17 57.09,40.17 57.09,-1.48 -3.11,-1.48
DGND on Top Layer: 33.15,33.35 33.72,33.35 33.72,31.31 33.15,31.31
DGND on Bottom Layer: 34.22,12.52 35.77,12.52 35.77,11.73 34.22,11.73
DGND on Bottom Layer: 14.68,12.79 19.23,12.79 19.23,10.73 14.68,10.73
DGND on Bottom Layer: -3.11,40.17 57.09,40.17 57.09,-1.48 -3.11,-1.48
DGND on Inner2: -3.11,40.17 57.09,40.17 57.09,-1.48 -3.11,-1.48
DVCC on Top Layer: 24.17,32.07 26.42,32.07 26.42,29.59 24.17,29.59
DVCC on Bottom Layer: 15.68,13.88 19.23,13.88 19.23,13.1 15.68,13.1
